# EAGLE schematic solar (EAGLE 8.2.1)
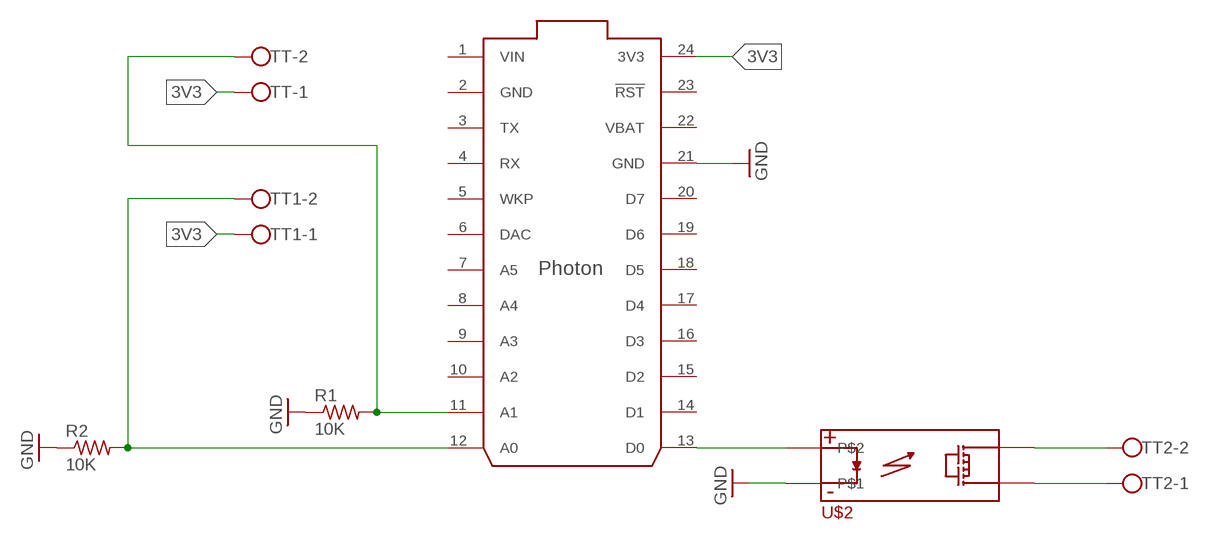
[diagram p0: schematic, sheet 1]

## Parts
R1  10K  R-US_0207/5V  [0207/5V]
R2  10K  R-US_0207/5V  [0207/5V]
TT  W237-102  [W237-102]
TT1  W237-102  [W237-102]
TT2  W237-102  [W237-102]
U$1  PHOTON_WITH_HEADERS  [PHOTON]
U$2  CPC1916Y  [SIP-POWER]

## Nets
3V3: TT1.1 TT.1 U$1.24(3V3)
GND: R1.1 R2.1 U$1.21(GND) U$2.P$1
N$1: R1.2 TT.2 U$1.11(A1)
N$2: R2.2 TT1.2 U$1.12(A0)
N$3: TT2.1 U$2.P$4
N$4: TT2.2 U$2.P$3
N$5: U$1.13(D0) U$2.P$2
Unconnected: U$1.3(TX) U$1.4(RX) U$1.5(WKP) U$1.6(DAC) U$1.7(A5) U$1.8(A4) U$1.9(A3) U$1.10(A2) U$1.14(D1) U$1.15(D2) U$1.16(D3) U$1.17(D4) U$1.18(D5) U$1.19(D6) U$1.20(D7) U$1.23(!RST)

## Power pins joined to a net without a drawn wire
GND: U$1.2(GND)
VBAT: U$1.22(VBAT)
VIN: U$1.1(VIN)

## Library data of the parts
R1 R2 = adafruit:R-US_: RESISTOR, American symbol
TT TT1 TT2 = con-wago-500:W237-102: WAGO SCREW CLAMP; MPN: 237-102; OC_FARNELL: unknown; OC_NEWARK: 70K9898; PARTNO: OSTTC020162
U$1 = Spark:PHOTON
U$2 = geoff:CPC1916Y

## Net classes
0 default: width 0.508 mm